# EAGLE board igreplane (EAGLE 5.06)
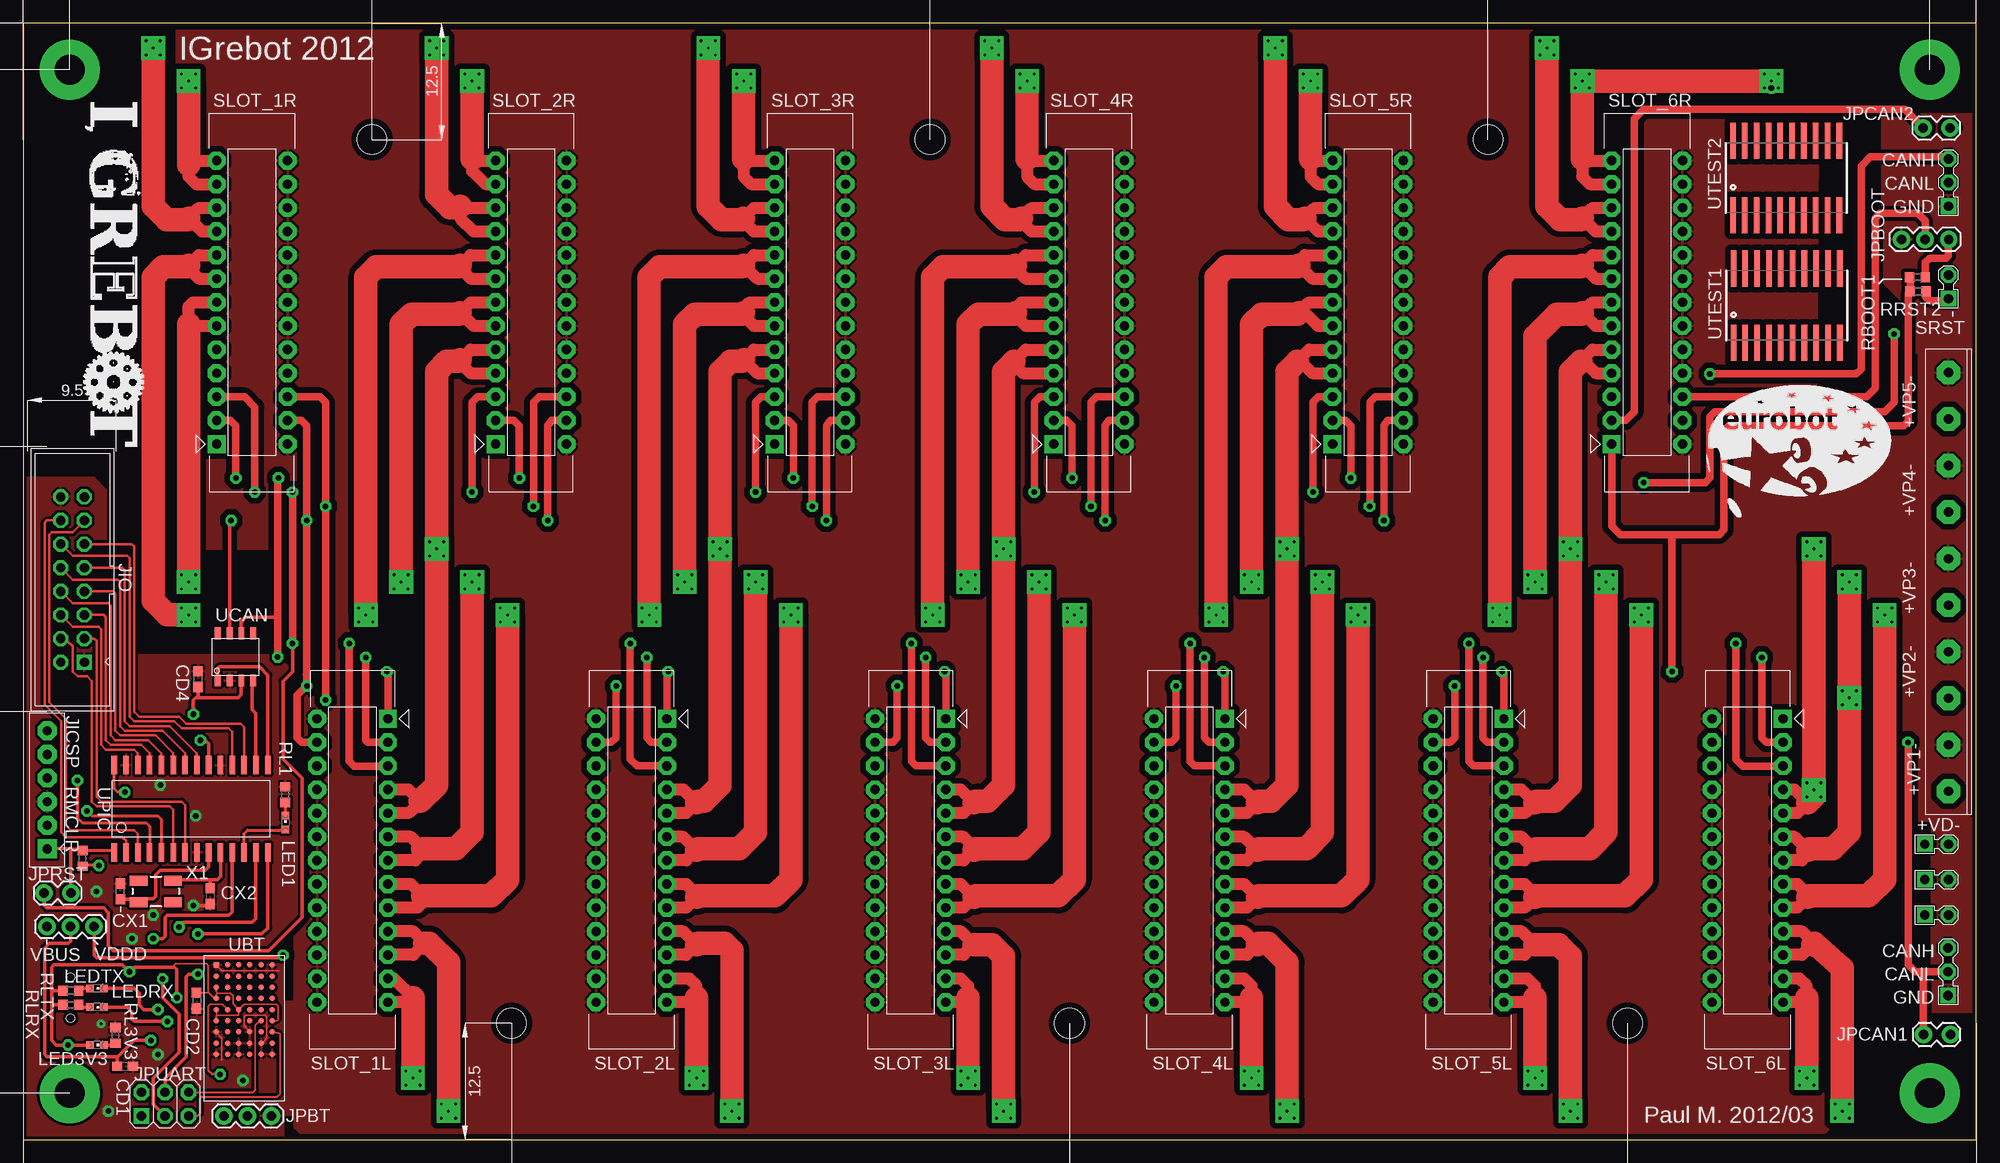
[diagram p2: board, top side]
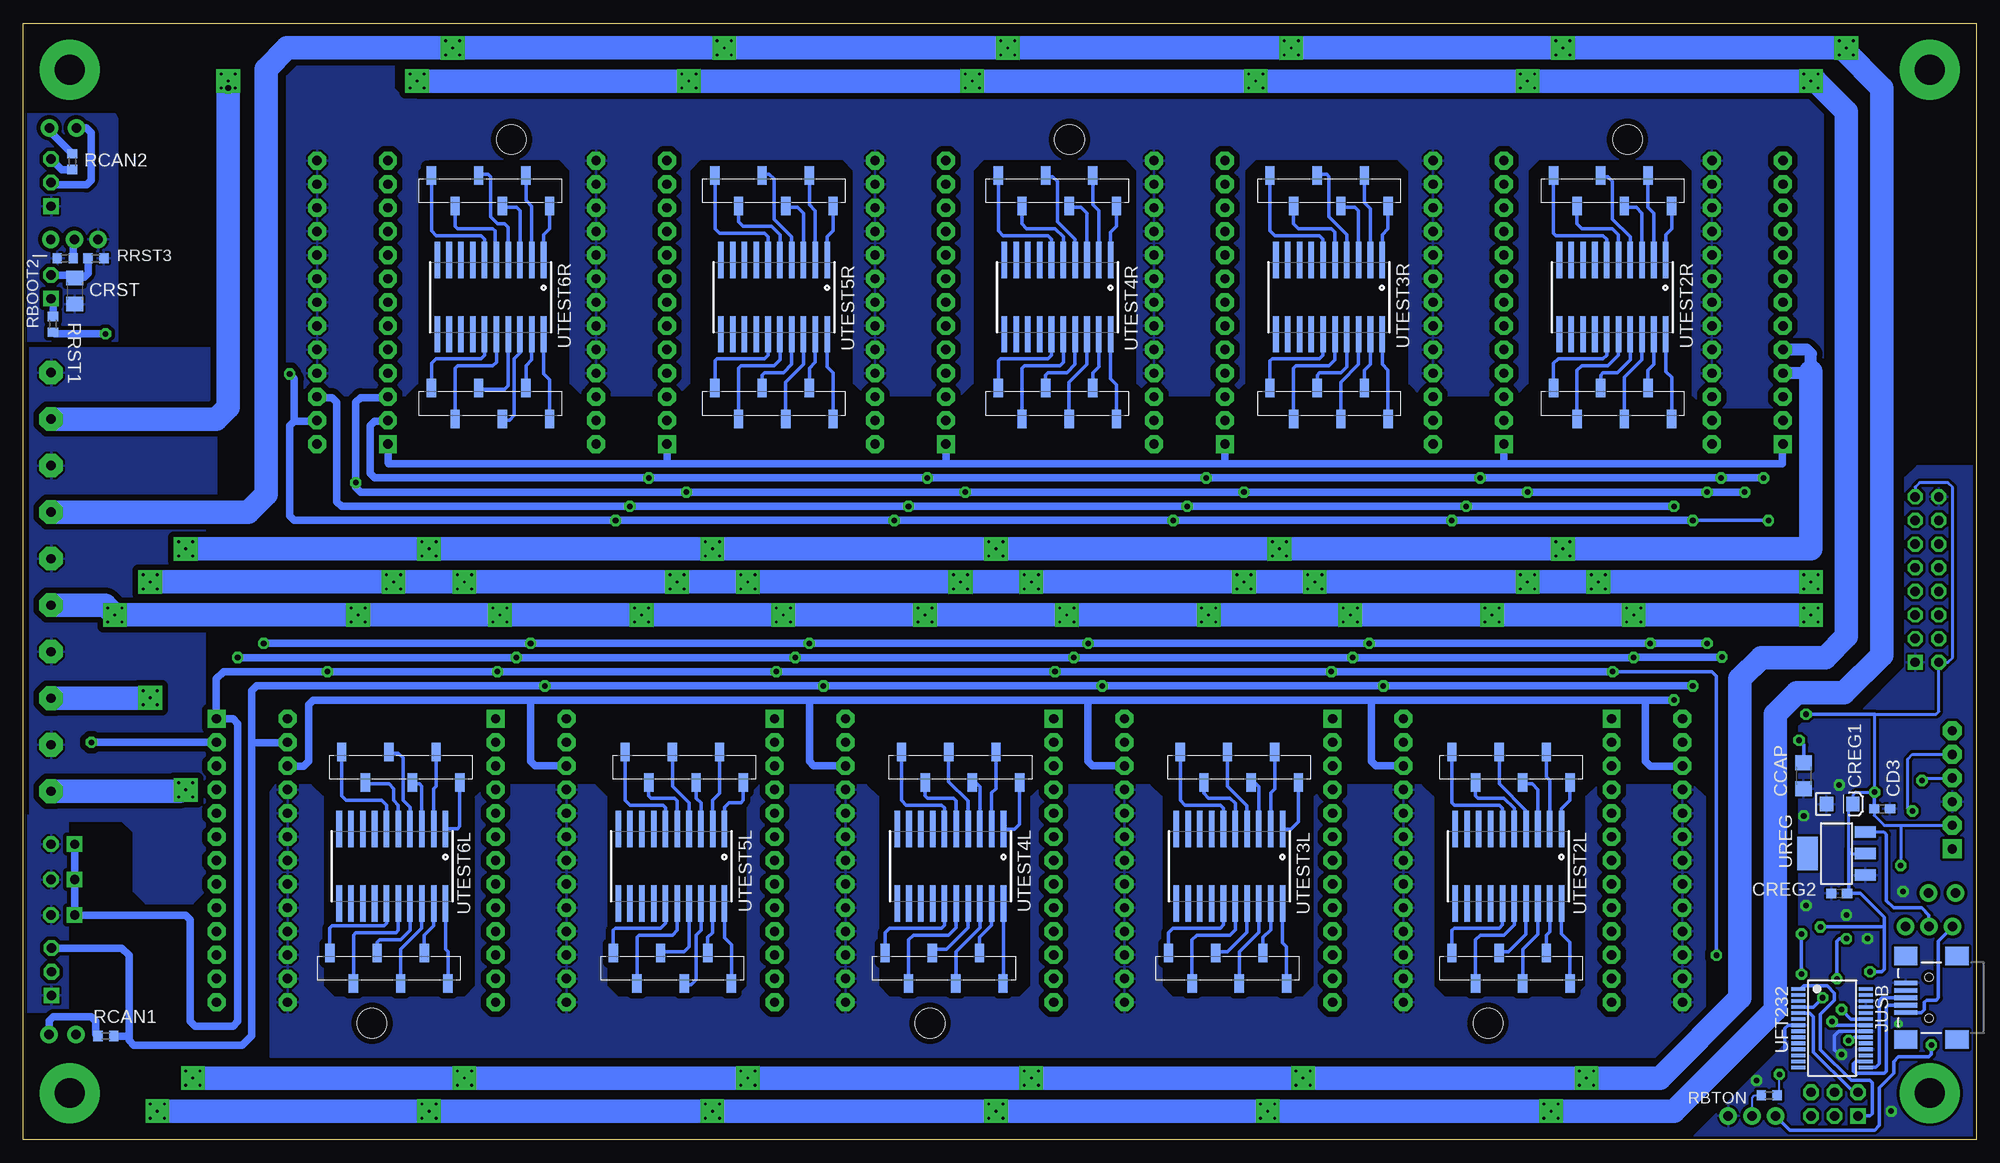
[diagram p3: board, bottom side, seen from below]

Size 210 x 120 mm. Coordinates in mm from the lower left corner, seen from the top.
Outline: 0,0 210,0 210,120 0,120 0,0
Copper layers (1+16): Top 0.035mm / dielectric 1.5mm / Bottom 0.035mm
Design rules: minimum track width 6mil, minimum drill 0.3mm, track to track 6mil, track to pad 6mil, pad to pad 6mil, via to via 6mil, smd to smd 6mil, copper to edge 14mil, drill to drill 8mil, minimum pad ring 12mil, minimum via ring 12mil, stop-mask expansion 4mil, vias tented up to drill 0mil, thermal gap 10mil
Net classes: 0 default: drill 0.3 mm, clearance 0.152 mm; 1 POWER: drill 0.3 mm, clearance 0.152 mm
Holes 3.2 mm at 97.5,107.5 112.5,12.5 52.5,12.5 172.5,12.5 37.5,107.5 157.5,107.5

## Footprints (pad centres in the part's own frame; a part is rotated, then mirrored left to right if it is on the bottom)
C1206 = smd 1.6 x 1.8: 1 -1.4,0; 2 1.4,0
C0603 = smd 1.1 x 1: 1 -0.85,0; 2 0.85,0
EIA3216 = smd 1.4 x 1.6: A 1.4,0; C -1.4,0
CON3-2.54 = drill 1 pad 1.676 square: 1 -2.54,0 | drill 1 pad 1.676 octagon: 2 0,0; 3 2.54,0
PICKIT_H = drill 1 pad 2.032 square: 1 -6.35,0 | drill 1 pad 2.032 octagon: 2 -3.81,0; 3 -1.27,0; 4 1.27,0; 5 3.81,0; 6 6.35,0
CON-HE10-16-2.54 = drill 1 square: 1 -8.89,-1.27 | drill 1 octagon: 2 -8.89,1.27; 3 -6.35,-1.27; 4 -6.35,1.27; 5 -3.81,-1.27; 6 -3.81,1.27; 7 -1.27,-1.27; 8 -1.27,1.27; 9 1.27,-1.27; 10 1.27,1.27; 11 3.81,-1.27; 12 3.81,1.27; 13 6.35,-1.27; 14 6.35,1.27; 15 8.89,-1.27; 16 8.89,1.27
1X03 = drill 1.016 pad 1.88: 1 0,0; 2 2.54,0; 3 5.08,0
1X02_LOCK = drill 1.016 pad 1.88: 1 -0.178,0; 2 2.718,0
CON2X3-2.54 = drill 1 pad 1.676 square: 1 -2.54,-1.27 | drill 1 pad 1.676 octagon: 2 -2.54,1.27; 3 0,-1.27; 4 0,1.27; 5 2.54,-1.27; 6 2.54,1.27
1X06_SMD_STRAIGHT_ALT = smd 1 x 2: 1 0,-1.65; 2 -2.54,1.65; 3 -5.08,-1.65; 4 -7.62,1.65; 5 -10.16,-1.65; 6 -12.7,1.65
USB-MINIB = smd 2.5 x 0.5: D+ 2.5,0; D- 2.5,0.8; GND 2.5,-1.6; ID 2.5,-0.8; VBUS 2.5,1.6 | smd 2.5 x 2: MTN1 -3,4.5; MTN2 2.5,4.5; MTN3 -3,-4.5; MTN4 2.5,-4.5 | hole 0.9: 0,2.2; 0,-2.2
CON2-2.54 = drill 1 pad 1.676 square: 1 -1.27,0 | drill 1 pad 1.676 octagon: 2 1.27,0
CON10-5.00 = drill 1 pad 2.54 octagon: 1 -22.5,0; 2 -17.5,0; 3 -12.5,0; 4 -7.5,0; 5 -2.5,0; 6 2.5,0; 7 7.5,0; 8 12.5,0; 9 17.5,0; 10 22.5,0
CHIPLED_0603 = smd 0.8 x 0.8: A 0,-0.75; C 0,0.75
R0603 = smd 1 x 1.1: 1 -0.85,0; 2 0.85,0
CON_WURTH_6130_26_216921 = drill 1 pad 1.93 square: 1 -15.24,3.81 | drill 1 pad 1.93 octagon: 2 -15.24,-3.81; 3 -12.7,3.81; 4 -12.7,-3.81; 5 -10.16,3.81; 6 -10.16,-3.81; 7 -7.62,3.81; 8 -7.62,-3.81; 9 -5.08,3.81; 10 -5.08,-3.81; 11 -2.54,3.81; 12 -2.54,-3.81; 13 0,3.81; 14 0,-3.81; 15 2.54,3.81; 16 2.54,-3.81; 17 5.08,3.81; 18 5.08,-3.81; 19 7.62,3.81; 20 7.62,-3.81; 21 10.16,3.81; 22 10.16,-3.81; 23 12.7,3.81; 24 12.7,-3.81; 25 15.24,3.81; 26 15.24,-3.81
VIA-5_0.3 = drill 0.3: P$1 -0.762,0.762; P$2 0.762,0.762; P$3 0.762,-0.762; P$4 -0.762,-0.762 | drill 0.3 pad 2.54 square: VIA 0,0
BGA53_PAN1321-SSP = smd 0.6 x 0.6: A1 -4.8,-3; A2 -3.6,-3; A3 -2.4,-3; A4 -1.2,-3; A5 0,-3; A6 1.2,-3; A7 2.4,-3; A8 3.6,-3; A9 4.8,-3; B1 -4.8,-1.8; B2 -3.6,-1.8; B3 -2.4,-1.8; B4 -1.2,-1.8; B5 0,-1.8; B6 1.2,-1.8; B7 2.4,-1.8; B8 3.6,-1.8; B9 4.8,-1.8; C1 -4.8,-0.6; C2 -3.6,-0.6; C3 -2.4,-0.6; C4 -1.2,-0.6; C5 0,-0.6; C6 1.2,-0.6; C7 2.4,-0.6; C8 3.6,-0.6; C9 4.8,-0.6; D1 -4.8,0.6; D2 -3.6,0.6; D3 -2.4,0.6; D4 -1.2,0.6; D5 0,0.6; D6 1.2,0.6; D7 2.4,0.6; D8 3.6,0.6; D9 4.8,0.6; E1 -4.8,1.8; E2 -3.6,1.8; E3 -2.4,1.8; E4 -1.2,1.8; E5 0,1.8; E6 1.2,1.8; E7 2.4,1.8; E8 3.6,1.8; E9 4.8,1.8; F1 -4.8,3; F2 -3.6,3; F3 -2.4,3; F4 -1.2,3; F5 0,3; F6 1.2,3; F7 2.4,3; F8 3.6,3; F9 4.8,3
SOIC8 = smd 0.635 x 1.27: 1 -1.905,-2.54; 2 -0.635,-2.54; 3 0.635,-2.54; 4 1.905,-2.54; 5 1.905,2.54; 6 0.635,2.54; 7 -0.635,2.54; 8 -1.905,2.54
SSOP28 = smd 0.4 x 1.5: 1 -4.225,-3.625; 2 -3.575,-3.625; 3 -2.925,-3.625; 4 -2.275,-3.625; 5 -1.625,-3.625; 6 -0.975,-3.625; 7 -0.325,-3.625; 8 0.325,-3.625; 9 0.975,-3.625; 10 1.625,-3.625; 11 2.275,-3.625; 12 2.925,-3.625; 13 3.575,-3.625; 14 4.225,-3.625; 15 4.225,3.625; 16 3.575,3.625; 17 2.925,3.625; 18 2.275,3.625; 19 1.625,3.625; 20 0.975,3.625; 21 0.325,3.625; 22 -0.325,3.625; 23 -0.975,3.625; 24 -1.625,3.625; 25 -2.275,3.625; 26 -2.925,3.625; 27 -3.575,3.625; 28 -4.225,3.625
SOIC28 = smd 0.6 x 2: 1 -8.255,-4.7; 2 -6.985,-4.7; 3 -5.715,-4.7; 4 -4.445,-4.7; 5 -3.175,-4.7; 6 -1.905,-4.7; 7 -0.635,-4.7; 8 0.635,-4.7; 9 1.905,-4.7; 10 3.175,-4.7; 11 4.445,-4.7; 12 5.715,-4.7; 13 6.985,-4.7; 14 8.255,-4.7; 15 8.255,4.7; 16 6.985,4.7; 17 5.715,4.7; 18 4.445,4.7; 19 3.175,4.7; 20 1.905,4.7; 21 0.635,4.7; 22 -0.635,4.7; 23 -1.905,4.7; 24 -3.175,4.7; 25 -4.445,4.7; 26 -5.715,4.7; 27 -6.985,4.7; 28 -8.255,4.7
SOT223 = smd 1.219 x 2.235: 1 -2.311,-3.099; 2 0,-3.099; 3 2.311,-3.099 | smd 3.6 x 2.2: 4 0,3.099
SO20W = smd 0.6 x 3.9: P$1 -5.715,-4; P$2 -4.445,-4; P$3 -3.175,-4; P$4 -1.905,-4; P$5 -0.635,-4; P$6 0.635,-4; P$7 1.905,-4; P$8 3.175,-4; P$9 4.445,-4; P$10 5.715,-4; P$11 5.715,4; P$12 4.445,4; P$13 3.175,4; P$14 1.905,4; P$15 0.635,4; P$16 -0.635,4; P$17 -1.905,4; P$18 -3.175,4; P$19 -4.445,4; P$20 -5.715,4
CRYSTAL-SMD-5X3 = smd 1.9 x 1.1: 1 -1.85,-1.15; 2 1.85,-1.15; 3 1.85,1.15; 4 -1.85,1.15

## Placement (x,y rotation side)
CCAP  10uF  [C1206]  18.58,39.12 270 bottom
CD1  100nF  [C0603]  10.96,7.87 0 top
CD2  100nF  [C0603]  18.63,14.93 270 top
CD3  100nF  [C0603]  10.13,35.56 0 bottom
CD4  100nF  [C0603]  18.8,49.5 90 top
CREG1  10uF  [EIA3216]  14.7,36.07 0 bottom
CREG2  220nF  [C0603]  14.73,26.45 180 bottom
CRST  100nF  [C1206]  204.47,91.22 270 bottom
CX1  22pF  [C0603]  10.45,26.67 90 top
CX2  22pF  [C0603]  20.1,26.16 270 top
JCAN1  SIL3  [CON3-2.54]  206.98,18.03 90 top
JCAN2  SIL3  [CON3-2.54]  207.01,102.87 90 top
JICSP  PICKIT_H  [PICKIT_H]  2.57,37.59 90 top
JIO  HE10-16  [CON-HE10-16-2.54]  5.3,60.2 90 top
JPBOOT  JUMPER-3PTH  [1X03]  207.04,96.77 180 top
JPBT  JUMPER-3PTH  [1X03]  21.59,2.54 0 top
JPCAN1  [1X02_LOCK]  207.04,11.29 180 top
JPCAN2  [1X02_LOCK]  207.01,108.75 180 top
JPRST  [1X02_LOCK]  2.41,26.51 0 top
JPUART  SIL2X3  [CON2X3-2.54]  15.24,3.81 0 top
JPVUSB  JUMPER-3PTH  [1X03]  2.54,22.89 0 top
JTEST2L1  [1X06_SMD_STRAIGHT_ALT]  56.38,40.01 180 bottom
JTEST2L2  [1X06_SMD_STRAIGHT_ALT]  43.68,18.42 0 bottom
JTEST2R1  [1X06_SMD_STRAIGHT_ALT]  45.46,101.99 180 bottom
JTEST2R2  [1X06_SMD_STRAIGHT_ALT]  32.76,79.13 0 bottom
JTEST3L1  [1X06_SMD_STRAIGHT_ALT]  85.59,40.01 180 bottom
JTEST3L2  [1X06_SMD_STRAIGHT_ALT]  74.16,18.42 0 bottom
JTEST3R1  [1X06_SMD_STRAIGHT_ALT]  75.94,101.99 180 bottom
JTEST3R2  [1X06_SMD_STRAIGHT_ALT]  63.24,79.13 0 bottom
JTEST4L1  [1X06_SMD_STRAIGHT_ALT]  115.56,40.01 180 bottom
JTEST4L2  [1X06_SMD_STRAIGHT_ALT]  104.64,18.42 0 bottom
JTEST4R1  [1X06_SMD_STRAIGHT_ALT]  105.15,101.99 180 bottom
JTEST4R2  [1X06_SMD_STRAIGHT_ALT]  92.45,79.13 0 bottom
JTEST5L1  [1X06_SMD_STRAIGHT_ALT]  145.28,40.01 180 bottom
JTEST5R1  [1X06_SMD_STRAIGHT_ALT]  135.63,101.99 180 bottom
JTEST5R2  [1X06_SMD_STRAIGHT_ALT]  122.93,79.13 0 bottom
JTEST6L1  [1X06_SMD_STRAIGHT_ALT]  175.76,40.01 180 bottom
JTEST6R1  [1X06_SMD_STRAIGHT_ALT]  166.11,101.99 180 bottom
JTEST6R2  [1X06_SMD_STRAIGHT_ALT]  153.41,79.13 0 bottom
JTEST25L2  [1X06_SMD_STRAIGHT_ALT]  133.85,18.42 0 bottom
JTEST26L2  [1X06_SMD_STRAIGHT_ALT]  164.33,18.42 0 bottom
JUSB  USBSMD  [USB-MINIB]  5.08,15.24 180 bottom
JVDDD1  SIL2  [CON2-2.54]  205.74,24.13 0 top
JVDDD2  SIL2  [CON2-2.54]  205.74,31.75 0 top
JVDDD3  SIL2  [CON2-2.54]  205.74,27.94 0 top
JVDDP  MULTICOMP_PA001-10  [CON10-5.00]  207.01,59.94 90 top
LED1  [CHIPLED_0603]  28.19,34.07 0 top
LED3V3  [CHIPLED_0603]  7.91,10.16 270 top
LEDRX  [CHIPLED_0603]  7.91,14.22 270 top
LEDTX  [CHIPLED_0603]  7.91,16.26 270 top
RBOOT1  2k7  [R0603]  203.67,92.71 180 top
RBOOT2  4k7  [R0603]  205.49,94.74 0 bottom
RBTON  3.3k  [R0603]  22.27,4.75 180 bottom
RCAN1  120  [R0603]  201.11,11.12 180 bottom
RCAN2  120  [R0603]  204.72,105.12 90 bottom
RL1  270  [R0603]  28.16,37.08 270 top
RL3V3  270  [R0603]  9.91,11.21 270 top
RLRX  270  [R0603]  5.11,14.48 180 top
RLTX  270  [R0603]  5.11,16 180 top
RMCLR  4.7k  [R0603]  6.38,30.23 270 top
RRST1  100  [R0603]  206.79,87.63 270 bottom
RRST2  2k7  [R0603]  203.74,91.19 180 top
RRST3  4.7k  [R0603]  202.18,94.74 180 bottom
SLOT_1L  CON_IGREPLANE_SOCKET  [CON_WURTH_6130_26_216921]  35.4,30 270 top
SLOT_1R  CON_IGREPLANE_SOCKET  [CON_WURTH_6130_26_216921]  24.6,90 90 top
SLOT_2L  CON_IGREPLANE_SOCKET  [CON_WURTH_6130_26_216921]  65.4,30 270 top
SLOT_2R  CON_IGREPLANE_SOCKET  [CON_WURTH_6130_26_216921]  54.6,90 90 top
SLOT_3L  CON_IGREPLANE_SOCKET  [CON_WURTH_6130_26_216921]  95.4,30 270 top
SLOT_3R  CON_IGREPLANE_SOCKET  [CON_WURTH_6130_26_216921]  84.6,90 90 top
SLOT_4L  CON_IGREPLANE_SOCKET  [CON_WURTH_6130_26_216921]  125.4,30 270 top
SLOT_4R  CON_IGREPLANE_SOCKET  [CON_WURTH_6130_26_216921]  114.6,90 90 top
SLOT_5L  CON_IGREPLANE_SOCKET  [CON_WURTH_6130_26_216921]  155.4,30 270 top
SLOT_5R  CON_IGREPLANE_SOCKET  [CON_WURTH_6130_26_216921]  144.6,90 90 top
SLOT_6L  CON_IGREPLANE_SOCKET  [CON_WURTH_6130_26_216921]  185.4,30 270 top
SLOT_6R  CON_IGREPLANE_SOCKET  [CON_WURTH_6130_26_216921]  174.6,90 90 top
SRST  SIL2  [CON2-2.54]  207.01,91.66 90 top
U$1  VIA-5_0.3  [VIA-5_0.3]  44.45,117.35 0 top
U$2  VIA-5_0.3  [VIA-5_0.3]  73.66,117.35 0 top
U$3  VIA-5_0.3  [VIA-5_0.3]  104.14,117.35 0 top
U$4  VIA-5_0.3  [VIA-5_0.3]  134.62,117.35 0 top
U$5  VIA-5_0.3  [VIA-5_0.3]  163.83,117.35 0 top
U$6  VIA-5_0.3  [VIA-5_0.3]  45.72,3.05 0 top
U$7  VIA-5_0.3  [VIA-5_0.3]  76.2,3.05 0 top
U$8  VIA-5_0.3  [VIA-5_0.3]  105.41,3.05 0 top
U$9  VIA-5_0.3  [VIA-5_0.3]  135.89,3.05 0 top
U$10  VIA-5_0.3  [VIA-5_0.3]  166.37,3.05 0 top
U$11  VIA-5_0.3  [VIA-5_0.3]  195.58,3.05 0 top
U$12  VIA-5_0.3  [VIA-5_0.3]  13.97,117.35 0 top
U$13  VIA-5_0.3  [VIA-5_0.3]  41.91,6.6 0 top
U$14  VIA-5_0.3  [VIA-5_0.3]  72.39,6.6 0 top
U$15  VIA-5_0.3  [VIA-5_0.3]  101.6,6.6 0 top
U$16  VIA-5_0.3  [VIA-5_0.3]  191.77,6.6 0 top
U$17  VIA-5_0.3  [VIA-5_0.3]  162.56,6.6 0 top
U$18  VIA-5_0.3  [VIA-5_0.3]  132.08,6.6 0 top
U$19  VIA-5_0.3  [VIA-5_0.3]  77.47,113.79 0 top
U$20  VIA-5_0.3  [VIA-5_0.3]  167.64,113.79 0 top
U$21  VIA-5_0.3  [VIA-5_0.3]  138.43,113.79 0 top
U$22  VIA-5_0.3  [VIA-5_0.3]  17.78,113.79 0 top
U$23  VIA-5_0.3  [VIA-5_0.3]  48.26,113.79 0 top
U$24  VIA-5_0.3  [VIA-5_0.3]  107.95,113.79 0 top
U$25  VIA-5_0.3  [VIA-5_0.3]  166.37,63.5 0 top
U$26  VIA-5_0.3  [VIA-5_0.3]  105.41,63.5 0 top
U$27  VIA-5_0.3  [VIA-5_0.3]  44.45,63.5 0 top
U$28  VIA-5_0.3  [VIA-5_0.3]  192.53,63.5 0 top
U$29  VIA-5_0.3  [VIA-5_0.3]  135.89,63.5 0 top
U$30  VIA-5_0.3  [VIA-5_0.3]  74.93,63.5 0 top
U$31  VIA-5_0.3  [VIA-5_0.3]  139.7,59.94 0 top
U$32  VIA-5_0.3  [VIA-5_0.3]  196.34,59.94 0 top
U$33  VIA-5_0.3  [VIA-5_0.3]  170.18,59.94 0 top
U$34  VIA-5_0.3  [VIA-5_0.3]  162.56,59.94 0 top
U$35  VIA-5_0.3  [VIA-5_0.3]  132.08,59.94 0 top
U$37  VIA-5_0.3  [VIA-5_0.3]  40.64,59.94 0 top
U$38  VIA-5_0.3  [VIA-5_0.3]  48.26,59.94 0 top
U$39  VIA-5_0.3  [VIA-5_0.3]  71.12,59.94 0 top
U$40  VIA-5_0.3  [VIA-5_0.3]  109.22,59.94 0 top
U$41  VIA-5_0.3  [VIA-5_0.3]  78.74,59.94 0 top
U$42  VIA-5_0.3  [VIA-5_0.3]  101.6,59.94 0 top
U$43  VIA-5_0.3  [VIA-5_0.3]  17.78,59.94 0 top
U$44  VIA-5_0.3  [VIA-5_0.3]  36.83,56.39 0 top
U$45  VIA-5_0.3  [VIA-5_0.3]  52.07,56.39 0 top
U$46  VIA-5_0.3  [VIA-5_0.3]  17.78,56.39 0 top
U$47  VIA-5_0.3  [VIA-5_0.3]  97.79,56.39 0 top
U$48  VIA-5_0.3  [VIA-5_0.3]  82.55,56.39 0 top
U$49  VIA-5_0.3  [VIA-5_0.3]  67.31,56.39 0 top
U$50  VIA-5_0.3  [VIA-5_0.3]  200.15,56.39 0 top
U$51  VIA-5_0.3  [VIA-5_0.3]  173.99,56.39 0 top
U$52  VIA-5_0.3  [VIA-5_0.3]  113.03,56.39 0 top
U$53  VIA-5_0.3  [VIA-5_0.3]  158.75,56.39 0 top
U$54  VIA-5_0.3  [VIA-5_0.3]  143.51,56.39 0 top
U$55  VIA-5_0.3  [VIA-5_0.3]  128.27,56.39 0 top
U$56  VIA-5_0.3  [VIA-5_0.3]  196.34,47.5 0 top
U$57  VIA-5_0.3  [VIA-5_0.3]  192.53,37.59 90 top
U$58  VIA-5_0.3  [VIA-5_0.3]  187.96,113.79 0 top
UBT  PANASONIC_PAN1321-SPP  [BGA53_PAN1321-SSP]  23.77,13.97 270 top
UCAN  SN65HVD231Q  [SOIC8]  22.83,51.88 0 top
UFT232  FT232RL  [SSOP28]  15.49,11.97 270 bottom
UPIC  DSPIC33FJ128MC802-SO  [SOIC28]  18.03,35.56 0 top
UREG  V_REG_317SMD  [SOT223]  15.02,30.73 90 bottom
UTEST1  SOIC_20  [SO20W]  189.61,89.65 0 top
UTEST2  SOIC_20  [SO20W]  189.55,103.37 0 top
UTEST2L  SOIC_20  [SO20W]  50.31,29.37 180 bottom
UTEST2R  SOIC_20  [SO20W]  39.11,90.56 180 bottom
UTEST3L  SOIC_20  [SO20W]  80.31,29.37 180 bottom
UTEST3R  SOIC_20  [SO20W]  69.59,90.56 180 bottom
UTEST4L  SOIC_20  [SO20W]  110.31,29.37 180 bottom
UTEST4R  SOIC_20  [SO20W]  98.8,90.56 180 bottom
UTEST5L  SOIC_20  [SO20W]  140.31,29.37 180 bottom
UTEST5R  SOIC_20  [SO20W]  129.28,90.56 180 bottom
UTEST6L  SOIC_20  [SO20W]  170.31,29.37 180 bottom
UTEST6R  SOIC_20  [SO20W]  159.76,90.56 180 bottom
X1  [CRYSTAL-SMD-5X3]  14.26,26.67 0 top

## Tracks (layer width: path | path; a pad name or v marks a point on that pad's centre or on a via)
!MCLR
  Top 0.305: JICSP.1 5.08,31.24 6.47,31.24 RMCLR.1 9.56,31.08 UPIC.1
  Top 0.356: 5.08,31.24 5.08,26.56 JPRST.2
!RESET!  (via drill 0.6)
  Top 0.356: 28.96,53.85 28.96,50.29 27.94,49.28 27.94,40.89 29.97,38.86 29.97,23.88 26.42,20.32 9.65,20.32 9.14,20.83 9.14,24.38 8.64,24.89 2.54,24.89 2.23,25.2 JPRST.1
  Top 0.813: SLOT_2R.5 48.85,79.84 48.26,79.25 v48.26,69.6 | v35.05,53.34 35.05,40.64 35.56,40.13 39.18,40.13 SLOT_1L.5 | SLOT_2L.5 66.01,40.16 65.28,40.89 v65.28,53.34 | v28.96,69.6 28.96,53.85 v28.96,53.34 | SLOT_3R.5 79.33,79.84 78.74,79.25 v78.74,69.6 | SLOT_4R.5 109.3,79.84 108.71,79.25 v108.71,69.6 | SLOT_5R.5 139.28,79.84 138.68,79.25 v138.68,69.6 | SLOT_3L.5 95.98,40.16 95.5,40.64 v95.5,53.34 | SLOT_4L.5 125.96,40.16 125.48,40.64 v125.48,53.34 | SLOT_5L.5 155.93,40.16 155.45,40.64 v155.45,53.34 | v184.15,53.34 184.15,40.89 184.91,40.13 189.18,40.13 SLOT_6L.5 | SLOT_1R.5 23.79,79.84 24.89,78.74 v24.89,69.6 | v174.24,70.61 180.85,70.61 181.36,71.12 181.36,77.72 181.86,78.23 200.15,78.23 201.17,79.25 v201.17,86.61
  Bottom 0.813: v24.89,69.6 v28.96,69.6 v48.26,69.6 v78.74,69.6 v108.71,69.6 v138.68,69.6 173.74,69.6 174.24,70.1 v174.24,70.61 174.24,79.25 173.74,79.76 170.87,79.76 SLOT_6R.5 | 35.56,53.34 v35.05,53.34 | 35.56,53.34 v65.28,53.34 v95.5,53.34 v125.48,53.34 v155.45,53.34 v184.15,53.34 | v28.96,53.34 35.56,53.34 | v201.17,86.61 206.62,86.61 RRST1.2
+3V3  (via drill 0.6)
  Top 0.152: 26.77,12.83 UBT.F6 27.27,12.77 27.4,12.9 27.4,14.35 27.2,14.55 23.75,14.55 UBT.C5 | 20.8,13.35 23.1,13.35 23.17,13.43 UBT.C5 | 20.8,13.35 20.8,13.94 UBT.A5 | UBT.A6 20.77,13.37 20.8,13.35 | 20.8,15.75 20.77,15.47 UBT.A4 20.53,15.17 19.92,15.78 | 20.8,15.75 22.25,15.75 22.55,15.45 22.55,14.59 UBT.C5 | 19.92,15.78 CD2.1 | 16.4,18.9 19.7,18.9 19.9,18.7 19.9,15.8 19.92,15.78 | UBT.A3 20.77,15.93 20.8,15.75
  Top 0.203: 16.26,18.54 16.26,18.76 16.4,18.9
  Top 0.305: UPIC.28 9.78,37.72 10.16,37.34 v10.92,37.34 | v8.13,29.46 6.55,29.46 RMCLR.2
  Top 0.356: v18.29,45.72 18.29,47.24 18.54,47.5 18.8,47.5 | UCAN.3 23.46,47.84 23.11,47.5 18.8,47.5 | UPIC.13 25.02,23.75 24.64,23.37 17.27,23.37 v16.76,22.86 | 18.8,47.5 CD4.1 | v16.51,15.24 16.51,18.29 16.26,18.54 11.94,18.54 v11.43,18.03 10.67,18.8 3.3,18.8 3.05,18.54 3.05,16 | 3.05,14.48 3.05,10.67 3.56,10.16 4.32,10.16 | 3.05,14.48 3.05,16 | 4.32,10.16 v4.83,10.16 LED3V3.A | 4.32,10.16 4.36,10.21 | 3.05,16 RLTX.2 | 3.05,14.48 RLRX.2
  Bottom 0.305: JIO.15 6.57,70.14 6.1,70.61 3.05,70.61 2.54,70.1 2.54,51.82 3.05,51.31 JIO.2 4.03,46.01 4.32,45.72 10.92,45.72 v10.92,37.34 12.95,37.34 13.21,37.08 13.21,36.16 CREG1.A 13.72,35.4 13.72,31.24 13.72,30.99 13.46,30.73 UREG.2 | CD3.1 10.98,34.85 9.91,33.78 8.13,33.78 | 8.13,33.78 JICSP.2 | 8.13,33.78 v8.13,29.46
  Bottom 0.356: 10.92,45.72 v18.29,45.72 | 13.72,31.24 13.72,26.87 CREG2.1 12.48,26.45 9.91,23.88 9.91,22.86 | v11.43,18.03 10.16,18.03 9.91,18.29 9.91,22.86 | 9.91,22.86 v16.76,22.86 | CD3.1 10.98,37.28 v10.92,37.34 | UFT232.4 17.5,14.25 v16.51,15.24 | JPBT.1 20.07,1.02 10.92,1.02 10.41,1.52 10.41,5.59 8.89,7.11 8.89,8.38 8.38,8.89 5.08,8.89 4.83,9.14 v4.83,10.16
BOOTSTRAP  (via drill 0.6)
  Top 0.813: SLOT_1R.6 31.92,79.84 32.51,79.25 v32.51,68.07 v32.51,47.24 | SLOT_2R.6 55.46,79.84 54.86,79.25 v54.86,68.07 | SLOT_3R.6 85.43,79.84 84.84,79.25 v84.84,68.07 | SLOT_4R.6 115.4,79.84 114.81,79.25 v114.81,68.07 | SLOT_5R.6 145.37,79.84 144.78,79.25 v144.78,68.07 | SLOT_6R.6 198.2,79.84 199.14,80.77 199.14,99.06 199.64,99.57 203.71,99.57 204.5,98.77 JPBOOT.2
  Bottom 0.813: v32.51,68.07 v54.86,68.07 v84.84,68.07 v114.81,68.07 v144.78,68.07 175.77,68.07 176.28,68.58 176.28,79.25 176.78,79.76 178.33,79.76 SLOT_6R.6 | SLOT_6L.6 181.56,40.13 179.83,40.13 179.32,40.64 179.32,46.74 178.82,47.24 155.45,47.24 | 35.56,47.24 65.02,47.24 | 65.02,47.24 95.5,47.24 | 95.5,47.24 125.48,47.24 | 125.48,47.24 155.45,47.24 | 35.56,47.24 35.56,40.64 35.05,40.13 31.62,40.13 SLOT_1L.6 | v32.51,47.24 35.56,47.24 | SLOT_2L.6 64.54,40.16 65.02,40.64 65.02,47.24 | SLOT_3L.6 95.02,40.16 95.5,40.64 95.5,47.24 | SLOT_4L.6 125,40.16 125.48,40.64 125.48,47.24 | SLOT_5L.6 154.97,40.16 155.45,40.64 155.45,47.24 | RBOOT2.2 204.64,96.64 JPBOOT.2
BT_ON  (via drill 0.6)
  Top 0.152: UBT.B5 21.97,14.03 21.4,14.55 20.1,14.55 19.9,14.35 19.9,7.4
  Top 0.203: v21.17,7.01 20.29,7.01 19.9,7.4
  Bottom 0.203: v21.17,7.01 21.17,5 RBTON.1
BT_RXD
  Top 0.152: UBT.E6 25.47,12.77 24.95,12.3 24.95,5.3
  Top 0.203: 24.95,5.3 24.75,5.1 17.8,5.1 JPUART.6
BT_TXD
  Top 0.152: 27.6,4.9 27.6,11.3 27.4,11.5 26.84,11.5 UBT.F7
  Top 0.203: JPUART.5 18.74,2.54 19,2.8 19,4.4 19.2,4.6 27.3,4.6 27.6,4.9
CAN_RXD
  Top 0.356: UPIC.16 25.02,45.85 24.64,46.23 24.64,49.25 UCAN.4
CAN_TXD
  Top 0.356: UCAN.1 20.92,50.64 21.08,50.8 25.4,50.8 26.29,49.91 UPIC.15
CANH  (via drill 0.6)
  Top 0.356: 29.46,47.75 29.37,47.66 | 30.48,50.29 30.23,50.04 | UCAN.7 22.19,66.39 v22.35,66.55
  Top 0.813: SLOT_1R.4 29.89,77.3 30.48,76.71 v30.48,66.55 30.48,50.29 v30.48,48.77 29.46,47.75 29.46,43.18 29.94,42.7 SLOT_1L.4 | SLOT_2R.4 56.81,77.3 56.39,76.71 v56.39,66.55 | SLOT_2L.4 63.22,42.7 63.75,43.18 v63.75,48.77 | SLOT_3R.4 86.78,77.3 86.36,76.71 v86.36,66.55 | SLOT_4R.4 116.76,77.3 116.33,76.71 v116.33,66.55 | SLOT_5R.4 146.73,77.3 146.3,76.71 v146.3,66.55 | SLOT_3L.4 93.5,42.7 93.98,43.18 v93.98,48.77 | SLOT_4L.4 123.47,42.7 123.95,43.18 v123.95,48.77 | SLOT_5L.4 153.44,42.7 153.92,43.18 v153.92,48.77 | v181.36,82.3 197.1,82.3 197.61,82.8 197.61,104.65 198.63,105.66 206.76,105.66 JCAN2.3
  Bottom 0.356: v30.48,66.55 v22.35,66.55
  Bottom 0.813: v30.48,66.55 v56.39,66.55 v86.36,66.55 v116.33,66.55 v146.3,66.55 180.85,66.55 181.36,67.06 181.36,76.71 180.85,77.22 | 180.85,77.22 178.49,77.22 SLOT_6R.4 | 185.42,42.67 185.42,48.26 184.91,48.77 v153.92,48.77 v123.95,48.77 v93.98,48.77 v63.75,48.77 v30.48,48.77 | 185.42,42.67 181.62,42.67 SLOT_6L.4 | 185.42,42.67 185.42,11.18 186.44,10.16 198.12,10.16 198.63,10.67 198.63,11.18 | 198.63,11.18 198.63,19.81 199.39,20.57 JCAN1.3 | RCAN1.1 198.69,11.12 198.63,11.18 | 180.85,77.22 180.85,81.79 v181.36,82.3 | RCAN2.1 205.87,104.27 JCAN2.3
CANL  (via drill 0.6)
  Top 0.356: UCAN.6 23.46,55.72 23.88,56.13 27.1,56.13 27.35,55.88
  Top 0.813: SLOT_2R.3 52.75,77.3 53.34,76.71 v53.34,71.12 | SLOT_1L.3 37.06,42.7 36.83,42.93 v36.83,51.82 | SLOT_3R.3 82.21,77.3 82.8,76.71 v82.8,71.12 | SLOT_4R.3 112.18,77.3 112.78,76.71 v112.78,71.12 | SLOT_5R.3 142.16,77.3 142.75,76.71 v142.75,71.12 | SLOT_3L.3 97.51,42.7 97.03,43.18 v97.03,51.82 97.03,51.85 | 97.03,51.85 | SLOT_4L.3 127.48,42.7 127,43.18 v127,51.82 127,51.84 | 127,51.84 | SLOT_5L.3 157.45,42.7 156.97,43.18 v156.97,51.82 v156.97,51.83 | v156.97,51.83 | SLOT_2L.3 67.54,42.7 67.06,43.18 v67.06,51.82 67.06,51.86 | 67.06,51.86 | v27.35,51.87 27.35,55.88 27.35,71.04 v27.43,71.12 | SLOT_6L.3 187.42,42.7 186.94,43.18 v186.94,51.82 | SLOT_1R.3 22.27,77.3 22.86,76.71 v22.86,71.12 | v202.66,42.7 202.66,19.33 202.69,19.3 202.69,18.8 203.45,18.03 204.22,18.03 | 204.22,18.03 JCAN1.2 | JPCAN1.2 204.32,17.93 204.22,18.03 | SLOT_6R.3 172.3,77.3 173.23,78.23 173.23,109.73 174.24,110.74 202.29,110.74 JPCAN2.2
  Bottom 0.813: v22.86,71.12 v27.43,71.12 v53.34,71.12 v82.8,71.12 v112.78,71.12 v142.75,71.12 172.21,71.12 172.72,71.63 172.72,76.71 172.21,77.22 170.87,77.22 SLOT_6R.3 | v27.35,51.87 27.38,51.83 36.81,51.83 v36.83,51.82 v67.06,51.82 v97.03,51.82 v127,51.82 v156.97,51.82 v186.94,51.82 | SLOT_6L.3 v202.66,42.7 | JPCAN2.2 203.23,108.75 202.69,108.2 202.69,103.12 203.2,102.62 206.76,102.62 JCAN2.2
FTDI_RXD
  Bottom 0.356: JPUART.2 12.7,5.33 13.46,5.33 17.53,9.4 17.53,13.21 17.91,13.6 UFT232.5
FTDI_TXD
  Bottom 0.356: JPUART.1 11.43,2.54 11.18,2.79 11.18,6.1 11.43,6.35 13.46,6.35 16.76,9.65 16.76,13.46 15.24,14.99 15.24,15.75 16,16.51 18.54,16.51 18.86,16.2 UFT232.1
GND  (via drill 0.3, 0.6)
  Top 0.152: UBT.E8 25.67,10.37 26.15,10.9 26.15,13.2 26,13.35 23.9,13.35 23.75,13.2 23.75,12.24 UBT.D7 | UBT.A7 20.77,11.53 21.35,10.9 21.35,8.5 | UBT.A1 20.77,18.73 21.35,18.15 27.5,18.15
  Top 0.356: v18.29,25.15 19.93,25.15 CX2.2
  Bottom 0.356: UFT232.7 20.21,12.3 20.57,11.94 20.57,9.65 | UFT232.21 14.77,11.65 15.24,11.18 15.24,9.65 14.73,9.14 v14.48,9.14
  other vias: 9.14,3.05 7.87,26.67 13.97,24.13 14.73,38.1 18.54,34.8 23.62,6.35 8.38,12.45 11.68,21.59
  pour Bottom (isolate 0.61): 170.18,115.57 180.34,115.57 181.61,114.3 181.61,81.28 180.34,80.01 168.91,80.01 167.64,81.28 167.64,104.14 166.37,105.41 152.4,105.41 151.13,104.14 151.13,81.28 149.86,80.01 139.7,80.01 138.43,81.28 138.43,104.14 137.16,105.41 121.92,105.41 120.65,104.14 120.65,81.28 119.38,80.01 109.22,80.01 107.95,81.28 107.95,104.14 106.68,105.41 91.44,105.41 90.17,104.14 90.17,81.28 88.9,80.01 80.01,80.01 78.74,81.28 78.74,104.14 77.47,105.41 62.23,105.41 60.96,104.14 60.96,81.28 59.69,80.01 49.53,80.01 48.26,81.28 48.26,104.14 46.99,105.41 31.75,105.41 30.48,104.14 30.48,80.01 29.21,78.74 17.78,78.74 16.51,80.01 16.51,110.49 17.78,111.76 168.91,111.76 170.18,113.03
  pour Bottom (isolate 0.61): 29.21,36.83 29.21,13.97 34.29,8.89 183.39,8.89 183.39,37.34 182.88,38.1 179.07,38.1 177.8,36.83 177.8,16.51 176.53,15.24 162.56,15.24 161.29,16.51 161.29,36.83 160.02,38.1 148.59,38.1 147.32,36.83 147.32,16.51 146.05,15.24 133.35,15.24 132.08,16.51 132.08,36.83 130.81,38.1 119.38,38.1 118.11,36.83 118.11,16.51 116.84,15.24 102.87,15.24 101.6,16.51 101.6,36.83 100.33,38.1 88.9,38.1 87.63,36.83 87.63,16.51 86.36,15.24 72.39,15.24 71.12,16.51 71.12,36.83 69.85,38.1 59.69,38.1 58.42,36.83 58.42,16.51 57.15,15.24 43.18,15.24 41.91,16.51 41.91,36.83 40.64,38.1 30.48,38.1
  pour Bottom (isolate 0.61): 189.23,85.09 209.55,85.09 209.55,34.29 199.39,34.29 198.12,33.02 198.12,26.67 196.85,25.4 191.77,25.4 190.5,26.67 190.5,66.04 189.23,66.04
  pour Top (isolate 0.61): 16.51,119.38 16.51,64.77 17.78,63.5 27.94,63.5 29.21,62.23 29.21,1.27 30.48,0 193.04,0 194.31,1.27 194.31,33.02 195.58,34.29 210.06,34.29 209.8,76.2 209.8,85.34 203.2,85.34 202.95,76.45 202.69,76.2 192.79,76.2 193.04,119.38
  pour Top (isolate 0.305): 0,71.12 7.62,71.12 8.89,69.85 8.89,60.96 11.43,52.07 26.67,52.07 30.48,49.53 30.48,22.86 27.94,20.32 27.94,14.8 29.21,14.8 29.21,2.66 27.94,2.66 27.94,0 0,0
  pour Bottom (isolate 0.305): 0,72.39 6.35,72.39 7.62,71.12 7.62,50.8 12.7,45.72 17.78,45.72 19.05,44.45 19.05,11.94 20.83,9.91 30.73,0 0,0
  pour Bottom (isolate 0.406): 199.9,109.73 199.9,85.85 210.06,85.85 210.06,110.24 200.15,110.24
  pour Top (isolate 0.406): 199.9,110.24 199.9,92.2 203.45,88.65 203.45,84.58 210.06,84.58 210.06,110.24
  pour Top (isolate 0.406): 209.8,34.54 209.8,13.72 205.23,13.72 205.23,34.54
  pour Bottom (isolate 0.406): 209.8,34.8 209.8,13.72 205.23,13.72 205.23,34.8
IO1
  Top 0.254: JIO.3 7.62,53.85 7.87,53.59 7.87,36.83 8.38,36.32 17.02,36.32 17.4,35.94 UPIC.7
IO2
  Top 0.254: JIO.4 4.32,53.85 5.33,53.09 5.33,50.29 5.84,49.78 6.86,49.78 7.37,49.28 7.37,36.32 7.87,35.81 15.75,35.81 16.13,35.43 UPIC.6
IO3
  Top 0.254: JIO.5 8.64,56.39 8.89,56.13 8.89,42.93 9.4,42.42 12.7,42.42 13.59,41.53 UPIC.25
IO4
  Top 0.254: JIO.6 4.06,56.39 5.33,55.12 8.13,55.12 8.38,54.86 8.38,42.42 8.89,41.91 11.94,41.91 12.32,41.53 UPIC.26
IO5
  Top 0.254: JIO.7 9.65,58.93 9.91,58.67 9.91,43.94 10.41,43.43 14.22,43.43 16.13,41.53 UPIC.23
IO6
  Top 0.254: JIO.8 4.06,58.93 5.33,57.66 9.14,57.66 9.4,57.4 9.4,43.43 9.91,42.93 13.46,42.93 14.86,41.53 UPIC.24
IO7
  Top 0.254: JIO.9 10.67,61.47 10.92,61.21 10.92,44.96 11.43,44.45 15.75,44.45 18.67,41.53 UPIC.21
IO8
  Top 0.254: JIO.10 4.06,61.47 5.33,60.2 10.16,60.2 10.41,59.94 10.41,48.77 | 10.41,48.77 10.41,48.51 | UPIC.22 17.4,41.53 14.99,43.94 10.92,43.94 10.41,44.45 10.41,48.77
IO9
  Top 0.254: JIO.11 11.68,64.01 11.94,63.75 11.94,45.97 12.45,45.47 16.76,45.47 17.53,44.7 23.37,44.7 23.75,44.32 UPIC.17
IO10
  Top 0.254: JIO.12 4.06,64.01 5.33,62.74 11.18,62.74 11.43,62.48 11.43,45.47 11.94,44.96 16.26,44.96 17.02,44.2 22.1,44.2 22.48,43.81 UPIC.18
IO11
  Top 0.254: JIO.13 6.57,66.51 5.33,65.28 3.05,65.28 2.79,65.02 2.79,46.99 4.57,45.21 4.57,33.78 5.08,33.27 11.94,33.27 12.32,32.89 UPIC.3
IO12
  Top 0.254: JIO.14 2.54,66.55 2.29,66.29 2.29,46.74 4.06,44.96 4.06,33.02 4.57,32.51 10.67,32.51 11.05,32.13 UPIC.2
LED1
  Top 0.305: UPIC.12 23.75,32.89 24.13,33.27 27.64,33.27 LED1.A
N$1
  Bottom 0.813: JPCAN1.1 207.22,12.75 206.76,13.21 202.69,13.21 202.18,12.7 202.18,11.34 RCAN1.2
N$2
  Bottom 0.813: SRST.2 204.78,92.93 CRST.1 204.38,92.71 203.45,92.71 203.03,93.13 RRST3.2
N$3
  Top 0.813: RRST2.1 204.59,90.56 204.98,90.17 206.79,90.17 SRST.1
  Bottom 0.813: RRST1.1 206.79,90.17 SRST.1
N$4
  Bottom 0.813: JPCAN2.1 207.19,108.44 RCAN2.2
N$5  (via drill 0.6)
  Top 0.356: v14.48,13.97 12.95,13.97 12.45,14.48 12.45,15.75 11.94,16.26 LEDTX.C
  Bottom 0.356: UFT232.23 13.47,12.95 v14.48,13.97
N$6
  Top 0.813: RBOOT1.1 204.52,94.29 204.98,94.74 206.76,94.74 207.01,95 207.01,96.74 JPBOOT.1
N$7  (via drill 0.6)
  Top 0.356: LEDRX.C 11.18,14.22 11.68,13.72 11.68,12.95 11.94,12.7 v15.49,12.7
  Bottom 0.356: UFT232.22 15.13,12.3 v15.49,12.7
N$8
  Top 0.356: LEDTX.A 6.22,16.26 RLTX.1
N$9
  Top 0.356: LEDRX.A 6.22,14.22 RLRX.1
N$10
  Top 0.305: LED1.C 28.19,36.2 RL1.2
N$11
  Top 0.356: LED3V3.C 9.71,10.16 RL3V3.2
N$13
  Bottom 0.203: RBTON.2 23.85,4.75 24.1,4.5 24.1,2.57 JPBT.2
N$35
  Bottom 0.356: UTEST6R.P$20 154.04,82.3 153.41,81.67 JTEST6R2.1
N$52
  Bottom 0.356: UTEST6R.P$19 155.31,83.83 155.95,83.19 JTEST6R2.2 155.95,80.14
N$53
  Bottom 0.356: UTEST6R.P$18 156.59,84.59 157.22,83.95 157.22,77.86 157.73,77.35 158.36,77.35 JTEST6R2.3
N$54
  Bottom 0.356: UTEST6R.P$17 157.85,81.03 158.24,80.65 160.9,80.65 JTEST6R2.4
N$55
  Bottom 0.356: JTEST6R2.5 163.57,82.94 163.32,83.19 159.51,83.19 159.12,83.57 UTEST6R.P$16
N$56
  Bottom 0.356: UTEST6R.P$15 160.4,84.33 160.78,83.95 165.6,83.95 166.11,83.45 JTEST6R2.6
N$57
  Bottom 0.356: UTEST6R.P$6 160.4,96.78 160.78,97.16 165.6,97.16 166.11,97.67 JTEST6R1.1
N$58
  Bottom 0.356: JTEST6R1.2 163.57,98.18 163.32,97.92 159.51,97.92 159.25,97.67 159.25,94.69 UTEST6R.P$5
N$59
  Bottom 0.356: UTEST6R.P$4 157.85,98.05 158.24,98.43 159,98.43 159.76,99.19 159.76,103.51 160.01,103.77 160.9,103.77 JTEST6R1.3
N$60
  Bottom 0.356: UTEST6R.P$3 156.59,99.83 156.97,100.21 158.36,100.21 JTEST6R1.4
N$61
  Bottom 0.356: UTEST6R.P$2 155.31,100.34 155.95,100.97 JTEST6R1.5
N$62
  Bottom 0.356: UTEST6R.P$1 154.04,97.29 153.41,97.92 JTEST6R1.6
N$63
  Bottom 0.356: UTEST5R.P$20 123.56,83.06 122.93,82.43 JTEST5R2.1
N$64
  Bottom 0.356: UTEST5R.P$19 124.83,83.57 125.47,82.94 JTEST5R2.2
N$65
  Bottom 0.356: UTEST5R.P$18 126.11,83.32 128.01,81.41 JTEST5R2.3
N$66
  Bottom 0.356: UTEST5R.P$17 127.38,83.32 128.26,82.43 130.3,82.43 130.55,82.18 JTEST5R2.4
N$67
  Bottom 0.356: UTEST5R.P$16 128.65,83.83 129.28,83.19 132.84,83.19 133.09,82.94 JTEST5R2.5
N$68
  Bottom 0.356: UTEST5R.P$15 129.91,84.33 130.3,83.95 135.38,83.95 135.63,83.7 JTEST5R2.6
N$69
  Bottom 0.356: JTEST5R1.1 135.63,97.92 135.12,97.42 130.3,97.42 129.91,97.03 UTEST5R.P$6
N$70
  Bottom 0.356: JTEST5R1.2 133.09,98.69 132.58,98.18 129.53,98.18 128.65,97.29 UTEST5R.P$5
N$71
  Bottom 0.356: UTEST5R.P$4 127.38,97.03 129.28,98.94 129.28,103.26 129.79,103.77 130.42,103.77 JTEST5R1.3
N$72
  Bottom 0.356: UTEST5R.P$3 126.11,99.58 126.74,100.21 127.88,100.21 JTEST5R1.4
N$73
  Bottom 0.356: UTEST5R.P$2 124.83,99.83 125.47,100.46 JTEST5R1.5
N$74
  Bottom 0.356: UTEST5R.P$1 123.56,97.03 122.93,97.67 JTEST5R1.6
N$75
  Bottom 0.356: UTEST4R.P$20 93.08,81.8 92.45,81.16 JTEST4R2.1
N$76
  Bottom 0.356: UTEST4R.P$19 94.36,83.06 94.99,82.43 JTEST4R2.2
N$77
  Bottom 0.356: UTEST4R.P$18 95.62,83.32 97.53,81.41 JTEST4R2.3
N$78
  Bottom 0.356: UTEST4R.P$17 96.89,83.32 97.78,82.43 99.82,82.43 100.07,82.18 JTEST4R2.4
N$79
  Bottom 0.356: UTEST4R.P$16 98.17,83.57 98.55,83.19 102.36,83.19 102.61,82.94 JTEST4R2.5
N$80
  Bottom 0.356: UTEST4R.P$15 99.44,84.33 99.82,83.95 104.9,83.95 105.15,83.7 JTEST4R2.6
N$81
  Bottom 0.356: UTEST4R.P$6 99.44,96.78 99.82,97.16 104.64,97.16 105.15,97.67 JTEST4R1.1
N$82
  Bottom 0.356: UTEST4R.P$5 98.17,97.03 99.05,97.92 102.1,97.92 102.61,98.43 JTEST4R1.2
N$83
  Bottom 0.356: UTEST4R.P$4 96.89,96.78 98.8,98.69 98.8,103 99.31,103.51 99.94,103.51 JTEST4R1.3
N$84
  Bottom 0.356: UTEST4R.P$3 95.62,99.58 96.26,100.21 97.4,100.21 JTEST4R1.4
N$85
  Bottom 0.356: UTEST4R.P$2 94.36,99.83 94.99,100.46 JTEST4R1.5
N$86
  Bottom 0.356: UTEST4R.P$1 93.08,97.54 92.45,98.18 JTEST4R1.6
N$87
  Bottom 0.356: UTEST3R.P$20 63.88,83.32 63.24,82.68 JTEST3R2.1
N$88
  Bottom 0.356: UTEST3R.P$19 65.14,83.32 65.78,82.68 JTEST3R2.2
N$89
  Bottom 0.356: UTEST3R.P$18 66.42,83.32 68.32,81.41 JTEST3R2.3
N$90
  Bottom 0.356: UTEST3R.P$17 67.69,83.06 68.32,82.43 70.61,82.43 70.86,82.18 JTEST3R2.4
N$91
  Bottom 0.356: UTEST3R.P$16 68.95,83.83 69.59,83.19 73.15,83.19 73.4,82.94 JTEST3R2.5
N$92
  Bottom 0.356: UTEST3R.P$15 70.22,84.33 70.61,83.95 75.69,83.95 75.94,83.7 JTEST3R2.6
N$93
  Bottom 0.356: UTEST3R.P$6 70.22,96.78 70.61,97.16 75.43,97.16 75.94,97.67 JTEST3R1.1
N$94
  Bottom 0.356: UTEST3R.P$5 68.95,97.54 69.34,97.92 72.89,97.92 73.4,98.43 JTEST3R1.2 | JTEST3R1.2 73.4,100.46 73.15,100.72 73.15,100.59 JTEST3R1.2
N$95
  Bottom 0.356: UTEST3R.P$4 67.69,97.29 69.59,99.19 69.59,103.51 69.84,103.77 70.73,103.77 JTEST3R1.3
N$96
  Bottom 0.356: UTEST3R.P$3 66.42,99.83 66.8,100.21 68.19,100.21 JTEST3R1.4
N$97
  Bottom 0.356: UTEST3R.P$2 65.14,100.08 65.78,100.72 JTEST3R1.5
N$98
  Bottom 0.356: UTEST3R.P$1 63.88,97.29 63.24,97.92 JTEST3R1.6
N$99
  Bottom 0.356: UTEST2R.P$20 33.4,82.56 32.76,81.92 JTEST2R2.1
N$100
  Bottom 0.356: UTEST2R.P$19 34.66,83.32 35.3,82.68 JTEST2R2.2
N$101
  Bottom 0.356: UTEST2R.P$18 35.94,83.83 37.84,81.92 JTEST2R2.3
N$102
  Bottom 0.356: UTEST2R.P$17 37.2,83.83 38.6,82.43 40.13,82.43 40.38,82.18 JTEST2R2.4
N$103
  Bottom 0.356: UTEST2R.P$16 38.48,84.33 39.62,83.19 42.41,83.19 42.92,82.68 JTEST2R2.5
N$104
  Bottom 0.356: UTEST2R.P$15 39.74,84.33 40.13,83.95 44.95,83.95 45.46,83.45 JTEST2R2.6
N$105
  Bottom 0.356: UTEST2R.P$6 39.74,96.78 40.13,97.16 45.21,97.16 45.46,97.42 JTEST2R1.1
N$106
  Bottom 0.356: UTEST2R.P$5 38.48,97.29 39.11,97.92 42.41,97.92 42.92,98.43 JTEST2R1.2
N$107
  Bottom 0.356: UTEST2R.P$4 37.2,97.03 39.11,98.94 39.11,103 39.62,103.51 40.25,103.51 JTEST2R1.3
N$108
  Bottom 0.356: UTEST2R.P$3 35.94,99.58 36.57,100.21 37.71,100.21 JTEST2R1.4
N$109
  Bottom 0.356: UTEST2R.P$2 34.66,99.58 35.3,100.21 JTEST2R1.5
N$110
  Bottom 0.356: UTEST2R.P$1 33.4,97.29 32.76,97.92 JTEST2R1.6
N$111
  Bottom 0.356: UTEST2L.P$6 50.95,35.59 51.3,35.95 56.13,35.95 56.38,36.2 JTEST2L1.1
N$112
  Bottom 0.356: UTEST2L.P$5 49.68,35.59 50.79,36.71 53.59,36.71 53.84,36.96 JTEST2L1.2
N$113
  Bottom 0.356: UTEST2L.P$4 48.41,35.34 51.3,38.23 JTEST2L1.3
N$114
  Bottom 0.356: UTEST2L.P$3 47.14,37.62 47.75,38.23 48.63,38.23 JTEST2L1.4
N$115
  Bottom 0.356: UTEST2L.P$2 45.87,38.64 46.22,39 JTEST2L1.5
N$116
  Bottom 0.356: UTEST2L.P$1 44.6,35.54 43.68,36.46 JTEST2L1.6
N$117
  Bottom 0.356: UTEST3L.P$6 80.95,35.62 81.27,35.95 85.08,35.95 85.59,36.46 JTEST3L1.1
N$118
  Bottom 0.356: UTEST3L.P$5 79.68,36.13 80.26,36.71 82.54,36.71 83.05,37.22 JTEST3L1.2
N$119
  Bottom 0.356: UTEST3L.P$4 78.41,35.88 80.51,37.98 JTEST3L1.3
N$120
  Bottom 0.356: UTEST3L.P$3 77.14,37.91 77.46,38.23 77.84,38.23 JTEST3L1.4
N$121
  Bottom 0.356: UTEST3L.P$2 75.87,37.29 75.43,37.73 JTEST3L1.5
N$122
  Bottom 0.356: UTEST3L.P$1 73.69,33.37 72.89,34.17 JTEST3L1.6
N$123
  Bottom 0.356: UTEST4L.P$6 110.95,35.65 111.25,35.95 115.06,35.95 115.56,36.46 JTEST4L1.1
N$124
  Bottom 0.356: UTEST4L.P$5 109.68,36.41 109.98,36.71 112.77,36.71 113.02,36.96 JTEST4L1.2
N$125
  Bottom 0.356: UTEST4L.P$4 108.41,36.41 110.48,38.49 JTEST4L1.3
N$126
  Bottom 0.356: UTEST4L.P$3 107.14,37.94 107.44,38.23 107.82,38.23 JTEST4L1.4
N$127
  Bottom 0.356: UTEST4L.P$2 105.87,37.26 105.4,37.73 JTEST4L1.5
N$128
  Bottom 0.356: UTEST4L.P$1 103.41,33.37 102.86,33.92 JTEST4L1.6
N$129
  Bottom 0.356: UTEST5L.P$6 140.95,35.68 141.22,35.95 144.77,35.95 145.28,36.46 JTEST5L1.1
N$130
  Bottom 0.356: UTEST5L.P$5 139.68,36.44 139.95,36.71 142.49,36.71 142.74,36.96 JTEST5L1.2 142.74,39
N$131
  Bottom 0.356: UTEST5L.P$4 138.41,36.19 140.2,37.98 JTEST5L1.3
N$132
  Bottom 0.356: UTEST5L.P$3 137.14,36.19 137.66,36.71 JTEST5L1.4
N$133
  Bottom 0.356: UTEST5L.P$2 135.87,36.47 135.12,37.22 JTEST5L1.5
N$134
  Bottom 0.356: UTEST5L.P$1 134.6,35.71 134.11,36.2 132.84,36.2 132.58,36.46 JTEST5L1.6
N$135
  Bottom 0.356: UTEST6L.P$6 170.95,35.96 171.44,36.46 175.25,36.46 175.76,36.96 JTEST6L1.1
N$136
  Bottom 0.356: UTEST6L.P$5 169.68,35.96 170.17,36.46 170.17,37.73 170.68,38.23 173.09,38.23 JTEST6L1.2
N$137
  Bottom 0.356: UTEST6L.P$4 168.41,35.7 169.16,36.46 169.16,41.03 169.67,41.54 170.56,41.54 JTEST6L1.3
N$138
  Bottom 0.356: UTEST6L.P$3 167.14,37.99 167.38,38.23 168.01,38.23 JTEST6L1.4
N$139
  Bottom 0.356: UTEST6L.P$2 165.87,37.72 165.6,37.98 JTEST6L1.5
N$140
  Bottom 0.356: JTEST6L1.6 163.06,33.66 163.32,33.41 164.56,33.41 UTEST6L.P$1
N$141
  Bottom 0.356: UTEST2L.P$20 44.6,22.13 43.68,21.22 JTEST2L2.1
N$142
  Bottom 0.356: UTEST2L.P$19 45.87,22.33 46.22,21.98 JTEST2L2.2
N$143
  Bottom 0.356: UTEST2L.P$18 47.14,22.08 48.76,20.45 JTEST2L2.3
N$144
  Bottom 0.356: UTEST2L.P$17 48.41,22.08 50.29,20.2 51.17,20.2 JTEST2L2.4
N$145
  Bottom 0.356: UTEST2L.P$16 49.68,23.09 50.79,21.98 53.33,21.98 53.84,21.47 JTEST2L2.5
N$146
  Bottom 0.356: UTEST2L.P$15 50.95,23.09 51.3,22.74 56.13,22.74 56.38,22.49 JTEST2L2.6
N$147
  Bottom 0.356: UTEST3L.P$20 74.6,21.14 74.16,20.71 JTEST3L2.1
N$148
  Bottom 0.356: UTEST3L.P$19 75.87,22.56 76.7,21.72 JTEST3L2.2
N$149
  Bottom 0.356: UTEST3L.P$18 77.14,22.3 79.24,20.2 JTEST3L2.3
N$150
  Bottom 0.356: UTEST3L.P$17 78.41,22.3 80.51,20.2 81.65,20.2 JTEST3L2.4
N$151
  Bottom 0.356: UTEST3L.P$16 79.68,22.56 80.26,21.98 83.81,21.98 84.32,21.47 JTEST3L2.5
N$152
  Bottom 0.356: UTEST3L.P$15 80.95,23.07 81.27,22.74 86.35,22.74 86.86,22.23 JTEST3L2.6
N$153
  Bottom 0.356: UTEST4L.P$20 104.6,16.82 JTEST4L2.1
N$154
  Bottom 0.356: UTEST4L.P$19 105.87,23.04 107.18,21.72 JTEST4L2.2
N$155
  Bottom 0.356: UTEST4L.P$18 107.14,22.79 109.72,20.2 JTEST4L2.3
N$156
  Bottom 0.356: UTEST4L.P$17 108.41,22.79 110.74,20.45 111.88,20.45 JTEST4L2.4
N$157
  Bottom 0.356: UTEST4L.P$16 109.68,22.79 110.48,21.98 114.29,21.98 114.8,21.47 JTEST4L2.5
N$158
  Bottom 0.356: UTEST4L.P$15 110.95,23.04 111.25,22.74 116.83,22.74 117.34,22.23 JTEST4L2.6
N$159
  Bottom 0.356: UTEST5L.P$20 134.6,21.71 133.85,20.96 JTEST25L2.1
N$160
  Bottom 0.356: UTEST5L.P$19 135.87,22.25 136.39,21.72 JTEST25L2.2
N$161
  Bottom 0.356: UTEST5L.P$18 137.14,22.5 137.66,21.98 137.66,17.15 138.17,16.64 138.8,16.64 JTEST25L2.3
N$162
  Bottom 0.356: UTEST5L.P$17 138.41,20.73 138.93,20.2 141.34,20.2 JTEST25L2.4
N$163
  Bottom 0.356: UTEST5L.P$16 139.68,22.5 140.2,21.98 143.76,21.98 144.01,21.72 JTEST25L2.5
N$164
  Bottom 0.356: UTEST5L.P$15 140.95,23.27 141.47,22.74 146.3,22.74 146.55,22.49 JTEST25L2.6
N$165
  Bottom 0.356: UTEST6L.P$20 164.6,20.46 164.33,20.2 JTEST26L2.1
N$166
  Bottom 0.356: UTEST6L.P$19 165.87,22.98 166.87,21.98 JTEST26L2.2
N$167
  Bottom 0.356: UTEST6L.P$18 167.14,22.73 169.41,20.45 JTEST26L2.3
N$168
  Bottom 0.356: JTEST26L2.4 171.95,21.22 171.7,21.47 169.41,21.47 168.41,22.48 UTEST6L.P$17
N$169
  Bottom 0.356: JTEST26L2.5 174.49,21.98 174.24,22.23 169.92,22.23 169.67,22.49 169.67,25.36 UTEST6L.P$16
N$170
  Bottom 0.356: UTEST6L.P$15 170.95,23.24 171.19,22.99 176.78,22.99 177.03,22.74 JTEST26L2.6
N$171  (via drill 3.2 pad 6.45)
  other vias: 5,115
N$172  (via drill 3.2 pad 6.45)
  other vias: 5,5
N$173  (via drill 3.2 pad 6.45)
  other vias: 205,5
N$174  (via drill 3.2 pad 6.45)
  other vias: 205,115
OSC1
  Top 0.356: UPIC.9 19.94,29.34 19.56,28.96 14.73,28.96 14.22,28.45 14.22,26.16 13.97,25.91 12.54,25.91 X1.1 12.11,25.82 CX1.1
OSC2
  Top 0.356: UPIC.10 21.21,28.32 20.83,27.94 20.07,27.94 | 20.07,27.94 16.24,27.94 X1.3 | CX2.1 20.1,27.91 20.07,27.94
PGC  (via drill 0.6)
  Top 0.305: UPIC.5 14.86,34.42 14.48,34.8 7.37,34.8 v6.86,35.31
  Bottom 0.305: JICSP.5 6.86,41.4 7.37,40.89 7.37,35.56 7.11,35.31 v6.86,35.31
PGD  (via drill 0.6)
  Top 0.305: UPIC.4 13.59,33.66 13.21,34.04 6.35,34.04 5.84,34.54 v5.84,38.61
  Bottom 0.305: JICSP.4 5.84,38.86 v5.84,38.61
UART_RXD  (via drill 0.6)
  Top 0.356: UPIC.14 26.29,22.73 25.65,22.1 v18.8,22.1 | v18.8,17.78 17.78,17.78 17.53,17.53 17.53,8.89 15.24,6.6 JPUART.4
  Bottom 0.356: v18.8,17.78 v18.8,22.1
UART_TXD  (via drill 0.6)
  Top 0.356: v14.99,17.27 14.99,15.24 16.76,13.46 16.76,9.4 13.97,6.6 13.97,3.81 JPUART.3 | UPIC.11 22.48,24.51 22.1,24.13 15.49,24.13 15.24,23.88 15.24,21.84 14.99,21.59 v13.97,21.59
  Bottom 0.356: v14.99,17.27 14.99,21.34 14.73,21.59 v13.97,21.59
USBDM
  Bottom 0.356: JUSB.D- 9.44,14.44 9.65,14.22 9.65,7.37 9.91,7.11 12.95,7.11 13.21,7.37 13.21,8.13 12.94,8.4 UFT232.16
USBDP
  Bottom 0.356: JUSB.D+ 10.16,15.24 10.41,14.99 10.41,8.13 10.79,7.75 UFT232.15
VBUS
  Bottom 0.356: JPVUSB.1 2.54,22.86 4.06,21.34 4.06,15.24 4.32,14.99 5.33,14.99 5.59,14.73 5.59,13.97 5.92,13.64 JUSB.VBUS
VCAP  (via drill 0.6)
  Top 0.356: UPIC.20 19.94,42.55 19.56,42.93 v19.05,42.93
  Bottom 0.356: v19.05,42.93 18.54,42.42 18.54,40.99 CCAP.1
VDDD  (via drill 0.6)
  Top 0.356: v27.94,19.81 27.69,19.56 7.87,19.56 7.62,19.81 JPVUSB.3
  Top 0.813: SLOT_1L.1 39.21,50.2 v39.12,50.29 | SLOT_2L.1 69.21,50.16 v69.34,50.29 | SLOT_3L.1 99.21,50.14 v99.06,50.29 | SLOT_4L.1 129.21,50.11 v129.03,50.29 | SLOT_5L.1 159.21,50.09 v159,50.29 | v177.29,50.29 177.29,65.02 176.78,65.02 | SLOT_6R.1 170.79,65.94 171.7,65.02 176.78,65.02 | 176.78,65.02 182.37,65.02 182.88,65.53 182.88,76.2 183.39,76.71 202.18,76.71 202.69,77.22 202.69,90.99 RRST2.2 202.89,92.64 RBOOT1.2
  Bottom 0.356: v39.12,50.29 28.45,50.29 27.94,49.78 v27.94,19.81
  Bottom 0.813: SLOT_2R.1 50.79,72.65 50.8,72.64 | 50.8,72.64 20.83,72.64 20.83,74.72 SLOT_1R.1 | 80.77,72.64 50.8,72.64 | 110.74,72.64 80.77,72.64 | 140.72,72.64 110.74,72.64 | 140.72,72.64 170.69,72.64 170.79,72.75 SLOT_6R.1 | v39.12,50.29 v69.34,50.29 v99.06,50.29 v129.03,50.29 v159,50.29 v177.29,50.29 188.47,50.29 189.23,49.53 189.23,45.26 SLOT_6L.1 189.18,45.21 187.45,45.21 186.94,44.7 186.94,12.7 187.45,12.19 191.52,12.19 192.02,12.7 192.02,23.62 192.53,24.13 JVDDD1.1 JVDDD3.1 JVDDD2.1 | SLOT_3R.1 80.79,72.66 80.77,72.64 | SLOT_4R.1 110.79,72.69 110.74,72.64 | SLOT_5R.1 140.79,72.72 140.72,72.64
VDDP1
  Top 1.27: SLOT_1L.7 41.43,37.62 42.7,36.35 41.43,35.08 SLOT_1L.9 | SLOT_2R.9 48.09,84.92 46.99,83.82 | SLOT_2R.7 48.09,82.38 46.82,83.65 | SLOT_3R.9 78.57,84.92 77.47,83.82 78.91,82.38 SLOT_3R.7 | SLOT_4R.9 107.78,84.92 106.51,83.65 | SLOT_4R.7 107.48,82.38 106.36,83.5 | SLOT_5R.9 138.26,84.92 137.16,83.82 | 136.99,83.65 137.16,83.82 | SLOT_5R.7 138.6,82.38 137.16,83.82 | SLOT_6R.9 168.74,84.92 167.64,83.82 | 167.47,83.65 167.64,83.82 | SLOT_6R.7 169.08,82.38 167.64,83.82 | SLOT_6L.7 190.47,37.62 191.9,36.2 | SLOT_6L.9 190.78,35.08 192.21,36.51 | SLOT_5L.7 161.13,37.62 162.56,36.2 161.44,35.08 SLOT_5L.9 | SLOT_4L.7 131.29,37.62 132.72,36.2 131.6,35.08 SLOT_4L.9 | SLOT_3L.7 100.81,37.62 102.23,36.2 101.12,35.08 SLOT_3L.9 | SLOT_2L.7 70.97,37.62 72.39,36.2 71.28,35.08 SLOT_2L.9
  Top 2.54: 42.7,36.35 44.45,38.1 U$27.VIA 44.45,82.55 45.55,83.65 46.82,83.65 46.99,83.82 | 106.51,83.65 106.36,83.5 105.41,82.55 U$26.VIA 105.41,38.1 103.66,36.35 102.39,36.35 102.23,36.2 | 136.99,83.65 135.89,82.55 U$29.VIA 135.89,38.1 134.14,36.35 132.87,36.35 132.72,36.2 | 167.47,83.65 166.37,82.55 U$25.VIA 166.37,38.1 164.62,36.35 162.72,36.35 162.56,36.2 | 77.47,83.82 77.3,83.65 76.03,83.65 74.93,82.55 U$30.VIA 74.93,38.1 73.18,36.35 72.55,36.35 72.39,36.2 | 191.9,36.2 192.21,36.51 192.53,36.83 U$57.VIA U$28.VIA
  Bottom 1.27: SLOT_1R.7 17.95,82.38 17.78,82.55 17.78,84.45 18.25,84.92 SLOT_1R.9
  Bottom 2.54: U$28.VIA U$25.VIA U$29.VIA U$26.VIA U$30.VIA | U$30.VIA U$27.VIA | U$27.VIA 17.78,63.5 17.78,82.55 | U$30.VIA U$27.VIA | JVDDP.1 193.19,37.44 U$57.VIA
VDDP2
  Top 1.27: SLOT_1L.11 41.68,32.54 42.95,31.27 | SLOT_1L.13 42.16,30 43.43,31.27 | SLOT_2R.13 48.09,90 46.99,88.9 48.43,87.46 SLOT_2R.11 | SLOT_3R.13 78.11,90 76.83,88.73 | SLOT_3R.11 78.57,87.46 77.3,88.73 | SLOT_4R.13 107.31,90 106.05,88.73 | SLOT_4R.11 107.78,87.46 106.51,88.73 | SLOT_5R.13 138.26,90 137.48,89.22 | 137.16,88.9 137.48,89.22 | SLOT_5R.11 139.24,87.46 137.48,89.22 | SLOT_6R.13 168.74,90 167.64,88.9 169.08,87.46 SLOT_6R.11 | SLOT_6L.11 190.47,32.54 191.9,31.11 | SLOT_6L.13 191.26,30 192.53,31.27 | SLOT_5L.11 161.13,32.54 162.56,31.11 161.44,30 SLOT_5L.13 | SLOT_4L.11 131.29,32.54 132.72,31.11 131.6,30 SLOT_4L.13 | SLOT_3L.11 101.12,32.54 102.39,31.27 | SLOT_3L.13 101.12,30 102.23,31.11 | SLOT_2L.11 70.97,32.54 72.39,31.11 71.28,30 SLOT_2L.13 | SLOT_1R.13 18.25,90 17.78,89.53 17.78,87.63 17.95,87.46 SLOT_1R.11
  Top 2.54: U$37.VIA 40.64,87.63 41.74,88.73 46.82,88.73 46.99,88.9 | U$38.VIA 48.26,33.02 46.51,31.27 43.43,31.27 42.95,31.27 42.93,31.24 | U$43.VIA 17.78,87.63 | U$39.VIA 71.12,87.63 72.22,88.73 76.83,88.73 77.3,88.73 77.47,88.9 | U$41.VIA 78.74,33.02 76.99,31.27 72.55,31.27 72.39,31.11 | U$42.VIA 101.6,87.63 102.7,88.73 106.05,88.73 106.51,88.73 106.68,88.9 | U$35.VIA 132.08,87.63 133.18,88.73 136.99,88.73 137.16,88.9 | U$34.VIA 162.56,86.36 164.93,88.73 167.47,88.73 167.64,88.9 | U$40.VIA 109.22,33.02 107.47,31.27 102.39,31.27 102.23,31.11 | U$31.VIA 139.7,33.02 137.95,31.27 132.87,31.27 132.72,31.11 | U$33.VIA 170.18,33.02 168.43,31.27 162.72,31.27 162.56,31.11 | U$32.VIA U$56.VIA 196.34,46.48 196.34,33.02 194.59,31.27 192.53,31.27 192.05,31.27 191.9,31.11
  Bottom 2.54: U$38.VIA U$37.VIA | U$37.VIA U$43.VIA | U$32.VIA U$33.VIA | U$33.VIA U$34.VIA | U$34.VIA U$31.VIA | U$31.VIA U$35.VIA | U$35.VIA U$40.VIA | U$40.VIA U$42.VIA | U$42.VIA U$41.VIA | U$41.VIA U$39.VIA | U$39.VIA U$38.VIA | U$38.VIA U$37.VIA | U$33.VIA U$34.VIA | U$31.VIA U$35.VIA | U$40.VIA U$42.VIA | U$41.VIA U$39.VIA | JVDDP.3 196.4,47.44 U$56.VIA
VDDP3
  Top 1.27: SLOT_1L.15 41.68,27.46 42.95,26.19 | SLOT_1L.17 42.42,24.92 43.69,26.19 | SLOT_2R.17 48.09,95.08 46.99,93.98 | SLOT_2R.15 48.09,92.54 46.82,93.81 | SLOT_3R.17 78.57,95.08 77.47,93.98 78.91,92.54 SLOT_3R.15 | SLOT_4R.17 107.78,95.08 106.68,93.98 | SLOT_4R.15 107.78,92.54 106.51,93.81 | SLOT_5R.17 137.79,95.08 136.53,93.81 | SLOT_5R.15 138.6,92.54 137.16,93.98 | SLOT_6R.17 168.74,95.08 167.64,93.98 169.08,92.54 SLOT_6R.15 | SLOT_6L.15 190.78,27.46 192.05,26.19 | SLOT_6L.17 190.78,24.92 191.9,26.04 | SLOT_5L.15 161.44,27.46 162.72,26.19 | SLOT_5L.17 161.44,24.92 162.56,26.04 | SLOT_4L.15 131.29,27.46 132.72,26.04 131.6,24.92 SLOT_4L.17 | SLOT_3L.15 100.81,27.46 102.23,26.04 101.12,24.92 SLOT_3L.17 | SLOT_2L.15 71.28,27.46 72.55,26.19 | SLOT_2L.17 71.28,24.92 72.39,26.04 | SLOT_1R.17 18.88,95.08 17.78,93.98 | SLOT_1R.15 18.88,92.54 17.61,93.81
  Top 2.54: U$44.VIA 36.83,92.71 37.93,93.81 46.82,93.81 46.99,93.98 | U$45.VIA 52.07,27.94 50.32,26.19 43.69,26.19 42.95,26.19 42.93,26.16 | U$49.VIA 67.31,92.71 68.41,93.81 77.3,93.81 77.47,93.98 | U$48.VIA 82.55,27.94 80.8,26.19 72.55,26.19 72.39,26.04 | U$47.VIA 97.79,92.71 98.89,93.81 106.51,93.81 106.68,93.98 | U$55.VIA 128.27,92.71 129.37,93.81 136.53,93.81 136.99,93.81 137.16,93.98 | U$53.VIA 158.75,92.71 159.85,93.81 167.47,93.81 167.64,93.98 | U$52.VIA 113.03,27.94 111.28,26.19 102.39,26.19 102.23,26.04 | U$54.VIA 143.51,27.94 141.76,26.19 132.87,26.19 132.72,26.04 | U$51.VIA 173.99,27.94 172.24,26.19 162.72,26.19 162.56,26.04 | U$50.VIA 200.15,27.94 198.4,26.19 192.05,26.19 191.9,26.04 | U$46.VIA 15.49,56.39 13.97,57.91 13.97,92.71 15.07,93.81 17.61,93.81 17.78,93.98
  Bottom 2.54: U$53.VIA U$51.VIA U$50.VIA 201.21,57.44 JVDDP.5 | U$53.VIA U$54.VIA | U$54.VIA U$55.VIA | U$55.VIA U$52.VIA | U$52.VIA U$47.VIA | U$46.VIA U$44.VIA U$45.VIA U$49.VIA U$48.VIA U$47.VIA | U$52.VIA U$47.VIA | U$55.VIA U$52.VIA | U$54.VIA U$55.VIA | U$53.VIA U$54.VIA
VDDP4
  Top 1.27: SLOT_1L.21 41.94,19.84 43.18,21.08 | SLOT_1L.19 41.94,22.38 43.21,21.11 | 47.16,100.16 SLOT_2R.21 | 46.99,100.33 47.16,100.16 | SLOT_2R.19 48.43,97.62 46.99,99.06 46.99,99.99 47.16,100.16 | SLOT_6R.21 168.74,100.16 167.64,99.06 169.08,97.62 SLOT_6R.19 | SLOT_4R.21 108.42,100.16 107.31,99.06 | SLOT_4R.19 108.42,97.62 107.14,98.89 | SLOT_5R.21 138.9,100.16 137.79,99.06 139.24,97.62 SLOT_5R.19 | SLOT_3R.21 78.57,100.16 77.47,99.06 | SLOT_3R.19 78.57,97.62 77.3,98.89 | SLOT_6L.19 191.29,22.38 192.56,21.11 | SLOT_6L.21 191.29,19.84 192.41,20.95 | SLOT_5L.19 161.13,22.38 162.56,20.95 161.44,19.84 SLOT_5L.21 | SLOT_4L.19 131.29,22.38 132.72,20.95 131.6,19.84 SLOT_4L.21 | SLOT_3L.19 100.81,22.38 102.23,20.95 101.12,19.84 SLOT_3L.21 | SLOT_2L.19 70.97,22.38 72.39,20.95 71.28,19.84 SLOT_2L.21 | SLOT_1R.21 18.88,100.16 17.78,99.06 19.22,97.62 SLOT_1R.19
  Top 2.54: U$1.VIA 44.45,101.6 45.89,100.16 46.82,100.16 46.99,100.33 | U$6.VIA 45.72,19.05 43.66,21.11 43.21,21.11 43.18,21.08 | U$2.VIA 73.66,100.33 75.1,98.89 77.3,98.89 77.47,99.06 | U$7.VIA 76.2,20.32 75.41,21.11 72.55,21.11 72.39,20.95 | U$3.VIA 104.14,100.33 105.58,98.89 107.14,98.89 107.31,99.06 | U$4.VIA 134.62,100.33 136.06,98.89 137.62,98.89 137.79,99.06 | U$5.VIA 163.83,100.33 165.27,98.89 167.47,98.89 167.64,99.06 | U$9.VIA 135.89,19.05 133.83,21.11 132.87,21.11 132.72,20.95 | U$11.VIA 195.58,18.41 195.43,18.57 192.56,21.11 192.41,20.95 | 13.97,113.54 13.97,100.33 15.41,98.89 17.61,98.89 17.78,99.06 | 13.97,113.54 13.97,116.84 | U$8.VIA 105.41,19.68 104.14,20.95 102.23,20.95 | U$10.VIA 166.37,19.68 165.1,20.95 162.56,20.95 | U$12.VIA 13.97,113.54
  Bottom 1.27: U$7.VIA 76.2,3.17
  Bottom 2.54: 14.48,117.35 U$1.VIA U$2.VIA U$3.VIA U$4.VIA U$5.VIA 181.61,117.35 183.9,115.06 183.9,69.34 185.79,67.44 JVDDP.7 | 14.48,117.35 10.16,113.03 10.16,52.07 14.22,48.01 19.3,48.01 21.59,45.72 21.59,13.97 32.51,3.05 U$6.VIA U$7.VIA U$8.VIA U$9.VIA U$10.VIA U$11.VIA | 14.48,117.35 U$12.VIA
VDDP5  (via drill 0.6)
  Top 1.27: SLOT_1L.23 39.85,17.3 41.91,15.24 41.43,14.76 SLOT_1L.25 | SLOT_2R.23 49.7,102.7 48.26,104.14 48.26,105.41 48.43,105.24 SLOT_2R.25 | 167.81,105.24 SLOT_6R.25 | 167.64,105.41 167.81,105.24 | SLOT_6R.23 168.44,102.7 167.64,103.5 167.64,105.07 167.81,105.24 | 138.6,105.24 SLOT_5R.25 | 138.43,105.41 138.6,105.24 | SLOT_5R.23 139.24,102.7 138.43,103.5 138.43,105.07 138.6,105.24 | 107.48,105.24 SLOT_4R.25 | 107.48,105.24 107.31,105.41 | SLOT_4R.23 108.75,102.7 107.95,103.5 107.95,105.41 107.78,105.24 107.48,105.24 | 77.64,105.24 SLOT_3R.25 | 77.47,105.41 77.64,105.24 | SLOT_3R.23 78.28,102.7 77.47,103.5 77.47,105.07 77.64,105.24 | SLOT_6L.23 190.98,17.3 191.77,16.51 191.77,15.24 | SLOT_6L.25 191.62,14.76 191.77,14.61 | SLOT_5L.25 162.41,14.76 162.56,14.61 162.56,16.51 161.77,17.3 SLOT_5L.23 | SLOT_4L.25 131.93,14.76 132.08,14.61 | SLOT_4L.23 131.29,17.3 132.08,16.51 132.08,15.24 | SLOT_3L.25 101.44,14.76 101.6,14.61 | SLOT_3L.23 100.81,17.3 101.6,16.51 101.6,15.24 | SLOT_2L.25 71.6,14.76 71.75,14.61 72.39,14.61 | SLOT_2L.23 71.6,17.3 72.39,16.51 72.39,15.24 | SLOT_1R.25 18.25,105.24 17.78,104.78 | SLOT_1R.23 18.59,102.7 17.78,103.5 17.78,105.41
  Top 2.54: U$23.VIA 48.26,105.41 | U$13.VIA 41.91,15.24 | U$19.VIA 77.47,105.41 | U$14.VIA 72.39,14.61 72.39,15.24 | U$24.VIA 107.95,105.41 | U$21.VIA 138.43,105.41 | 167.64,105.41 U$20.VIA U$58.VIA | U$15.VIA 101.6,14.61 101.6,15.24 | U$18.VIA 132.08,14.61 132.08,15.24 | U$17.VIA 162.56,14.61 162.56,15.24 | U$16.VIA 191.77,14.61 191.77,15.24 | U$22.VIA 17.78,105.41 17.78,104.78
  Bottom 2.54: U$20.VIA U$21.VIA U$24.VIA U$19.VIA U$23.VIA U$22.VIA 17.27,113.79 13.97,110.49 13.97,54.1 16.26,51.82 23.11,51.82 25.4,49.53 25.4,15.24 34.04,6.6 U$13.VIA U$14.VIA U$15.VIA U$18.VIA U$17.VIA U$16.VIA | JVDDP.9 189.26,77.44 187.96,78.74 v187.96,113.03 U$58.VIA
VUSB  (via drill 0.6)
  Top 0.356: 10.16,8.89 11.94,10.67 v13.72,10.67 | CD1.1 10.11,8.84 10.16,8.89 | 10.16,8.89 2.54,8.89 2.29,9.14 2.29,20.57 2.79,21.08 4.83,21.08 5.08,21.34 JPVUSB.2
  Bottom 0.305: 9.65,32.77 9.91,33.02 11.9,33.02 UREG.3
  Bottom 0.356: UFT232.20 13.13,11 13.46,10.67 v13.72,10.67 | JPVUSB.2 5.08,24.13 5.84,24.89 8.89,24.89 9.65,25.65 9.65,32.77

## Text on the board
tNames: IGrebot 2012 | CANH | CANL | GND | +VP5- | +VP4- | +VP3- | +VP2- | +VP1- | +VD- | CANH | VBUS | VDDD | CANL | GND | Paul M. 2012/03
Measures: 5x30mm | 30mm | 30mm | 120mm | 30mm